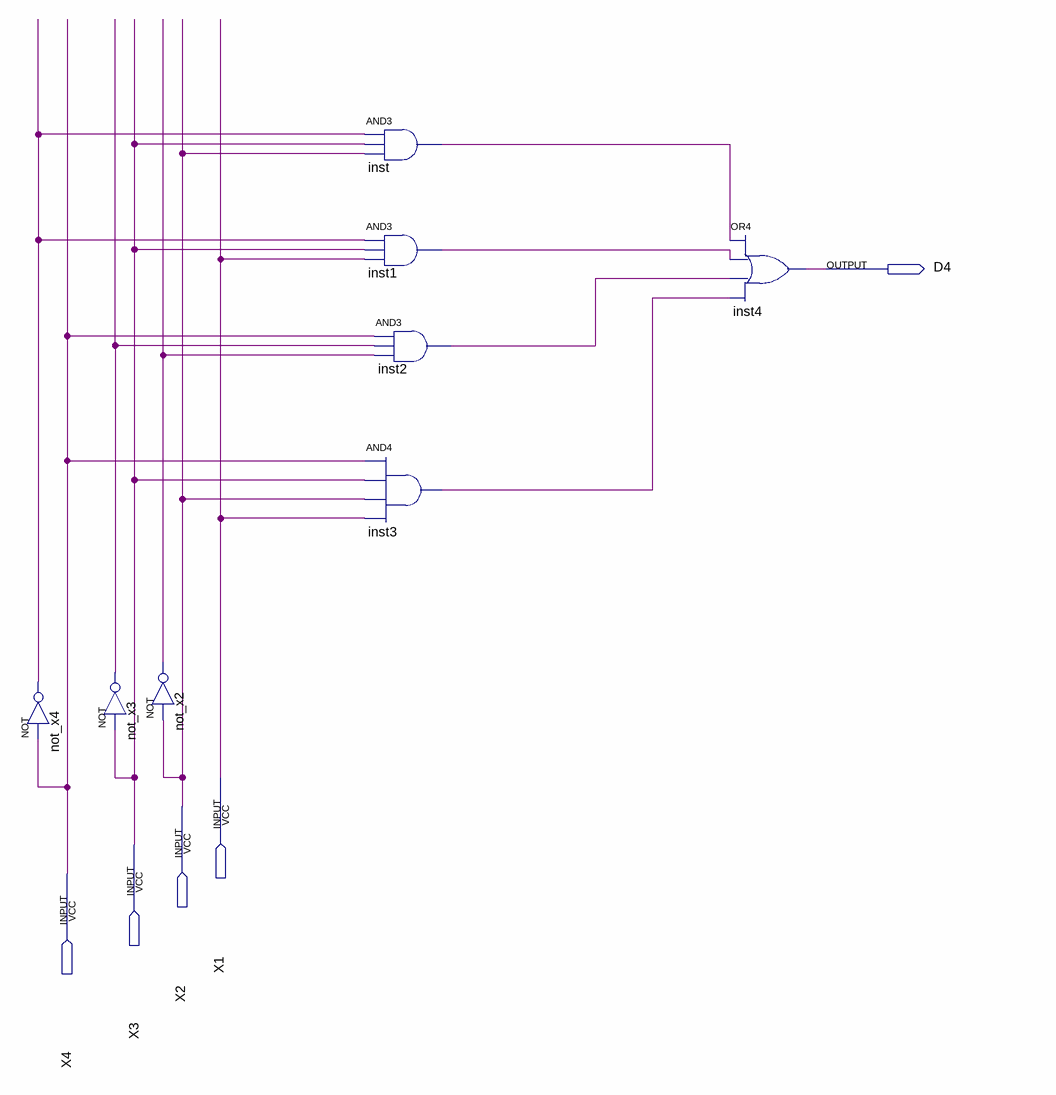
[diagram p0: schematic sheet]
// Quartus schematic conv_D4.bdf as structural Verilog: 8 symbols, 5 pins
module conv_D4 (
  input  X1,
  input  X2,
  input  X3,
  input  X4,
  output D4
);

  wire inst1_out, inst2_out, inst3_out, inst_out, not_x2_out, not_x3_out, not_x4_out;

  not not_x4 (not_x4_out, X4);
  not not_x2 (not_x2_out, X2);
  not not_x3 (not_x3_out, X3);
  and inst (inst_out, not_x4_out, X3, X2);
  and inst1 (inst1_out, not_x4_out, X3, X1);
  and inst2 (inst2_out, X4, not_x3_out, not_x2_out);
  and inst3 (inst3_out, X4, X3, X2, X1);
  or inst4 (D4, inst_out, inst1_out, inst2_out, inst3_out);
endmodule
